# Altium project npm1300_qeaa_config3.PrjPCB
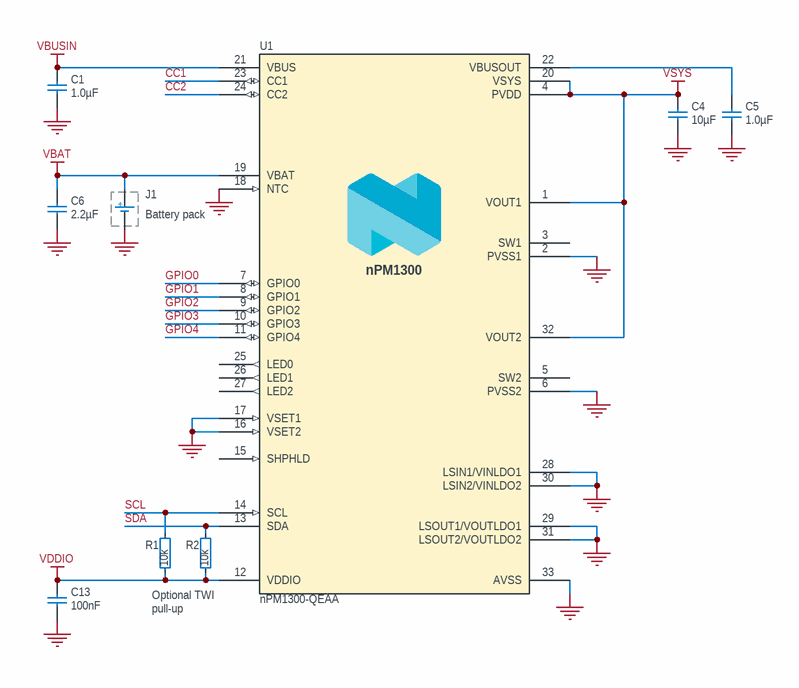
[diagram p0: npm1300_qeaa_config3.SchDoc]
1 sheet, 9 parts. Net scope: global (net labels, ports and power ports of the same name join across sheets).
Board file: npm1300_qeaa_config3.PcbDoc

## Sheet npm1300_qeaa_config3.SchDoc: nPM1300-QEAA Ref. Layout Config. 3
size A4; Revision: 1.2; SheetNumber: 1; SheetTotal: 1; DrawnBy: EISK; DocumentSize: A4; BoardTitle: nPM1300-QEAA Ref. Layout Config. 3; PCAName: nPM1300-QEAA; RefLayoutTitle: Minimal – only battery charging and VSYS output; Device: nPM1300-QEAA; Classification: PUBLIC; Config: 3

### Parts
C1  1.0µF  [CAPC1608X06L]
C4  10µF  [CAPC1608X06L]
C5  1.0µF  [CAPC1608X06L]
C6  2.2µF  [CAPC1608X06L]
C13  100nF  [CAPC0603X03L_C]
J1  Battery pack  [TP_2x1mm_TH]  (graphical)
R1  10k  [RESC0603X03L_C]
R2  10k  [RESC0603X03L_C]
U1  nPM1300-QEAA  [Nordic_QFN50P500X500X90-33N]

### Nets
GND: C1.1 C4.1 C5.1 C6.1 C13.2 J1.1(GND) U1.2(PVSS1) U1.6(PVSS2) U1.16(VSET2) U1.17(VSET1) U1.18(NTC) U1.28(LSIN1/VINLDO1) U1.29(LSOUT1/VOUTLDO1) U1.30(LSIN2/VINLDO2) U1.31(LSOUT2/VOUTLDO2) U1.33(AVSS)
VBAT: C6.2 J1.2(V+) U1.19(VBAT)
VBUSIN: C1.2 U1.21(VBUS)
VDDIO: C13.1 R1.2 R2.2 U1.12(VDDIO)
VSYS: C4.2 U1.1(VOUT1) U1.4(PVDD) U1.20(VSYS) U1.32(VOUT2)
CC1: U1.23(CC1)
CC2: U1.24(CC2)
GPIO0: U1.7(GPIO0)
GPIO1: U1.8(GPIO1)
GPIO2: U1.9(GPIO2)
GPIO3: U1.10(GPIO3)
GPIO4: U1.11(GPIO4)
SCL: R1.1 U1.14(SCL)
SDA: R2.1 U1.13(SDA)
NetC5_2: C5.2 U1.22(VBUSOUT)

Not connected (* = marked no-connect by the designer): U1 3(SW1) 5(SW2) 15(SHPHLD) 25(LED0) 26(LED1) 27(LED2)

### Notes on the sheet
- Optional TWI pull-up resistors
- Title
- Size
- Date:
- File:
- A4
- Config. No.
- Device
- Sheet
- Drawn By:
- Revision
- of
- Nordic Semiconductor does not warrant the accuracy or completeness of this documentation or any included information. Nordic Semiconductor makes no assurances that this design will meet specification, be appropriate for your application, or fit for any particular purpose, or that it will function in an implementation. Nordic Semiconductor also does not claim that the design is ready for production. It is your responsibility to thoroughly validate and test your design implementation to confirm the functionality of your application.
  © Nordic Semiconductor — All rights reserved.
- Classification:
- (in symbol Battery_TP) +
- (in symbol nPM1300-QEAA) nPM1300

### Library data of the parts
C1 C5 = C0603-1µ0-10V-X5R: Capacitor, Ceramic, 1.0µF 10V X5R 0603,±10%; Manufacturer: N.A.; Part number NEMS: 100200528; Pad Count: 2; Component Status: Active; Part Number: C0603-1µ0-10V-X5R; Manufacturer Part Number: N.A.; Footprint Doc: 0603; LatestRevisionDate: 2022-10-06; Published: 2022-10-06; Value: 1.0µF; Note: 10V; Artikkelnr Noca: N.A.; Part number IPS: N.A.; ComponentLink1URL: N.A.; ComponentLink1Description: Datasheet; ComponentLink2URL: N.A.; ComponentLink2Description: Supplier link; HelpURL: N.A.; Supplier 1: N.A.; Supplier Part Number 1: N.A.; Supplier 2: N.A.; Supplier Part Number 2: N.A.; Component Class: Capacitors; PartId: 100200528; Author: getr; Part number Norautron: N.A.
C4 = C0603-10µ: Capacitor, X5R, ±20%; Manufacturer: N.A.; Part number IPS: 00000007785; Part number NEMS: 100200275; Note: 6.3V; Artikkelnr Noca: 20039234; Pad Count: 2; Component Status: Active; Part Number: C0603-10µ; Manufacturer Part Number: N.A.; ComponentLink1URL: N.A.; ComponentLink1Description: Datasheet; ComponentLink2URL: N.A.; ComponentLink2Description: Supplier link; HelpURL: N.A.; Footprint Doc: 0603; LatestRevisionDate: 2011-01-17; Published: 2011-01-17; Value: 10µF; Supplier 1: N.A.; Supplier Part Number 1: N.A.; Supplier 2: N.A.; Supplier Part Number 2: N.A.; Component Class: Capacitors; PartId: 100200275; Author: rsk; Part number Norautron: N.A.
C6 = C0603-2.2µ-16V-X7R: Capacitor, Ceramic, X7R, ±10%, 16V; Manufacturer: Taiyo Yuden; Manufacturer Part Number: EMK107BB7225KA-T; Part number NEMS: 100200439; Component Status: Active; Pad Count: 2; Artikkelnr Noca: N.A.; Part Number: C0603-2.2µ-16V-X7R; PartId: 100200439; Component Class: Capacitors; Author: rsk; ComponentLink1URL: https://ds.yuden.co.jp/TYCOMPAS/ut/specSheet?pn=EMK107BB7225KA-T; ComponentLink1Description: Datasheet; ComponentLink2URL: https://ds.yuden.co.jp/TYCOMPAS/ut/detail?pn=EMK107BB7225KA-T&u=M; ComponentLink2Description: Supplier link; HelpURL: https://www.digikey.no/product-detail/en/taiyo-yuden/EMK107BB7225KA-T/587-5835-2-ND/4970646; LatestRevisionDate: 2020-10-13; Published: 2020-02-03; Footprint Doc: 0603; Value: 2.2µF; Note: 16V; Supplier 1: Digi-Key; Supplier Part Number 1: 587-5835-2-ND; Supplier 2: N.A.; Supplier Part Number 2: N.A.; Part number IPS: N.A.; Part number Norautron: N.A.
C13 = C0201-100n: Capacitor, X5R, ±10%, 100nF, 16V; Manufacturer: N.A.; Part number IPS: 00000001248, 00000002505; Part number Norautron: 262071862; Part number NEMS: 100200078; Pad Count: 2; Component Status: Active; Part Number: C0201-100n; PartId: 100200078; Component Class: Capacitors; Author: rsk; Manufacturer Part Number: N.A.; ComponentLink1URL: N.A.; ComponentLink1Description: Datasheet; ComponentLink2URL: N.A.; ComponentLink2Description: Supplier link; HelpURL: N.A.; Footprint Doc: 0201; LatestRevisionDate: 2024-06-27; Published: 2014-11-13; Value: 100nF; Note: 16V; Supplier 1: N.A.; Supplier Part Number 1: N.A.; Supplier 2: N.A.; Supplier Part Number 2: N.A.; Artikkelnr Noca: N.A.
J1 = Battery_TP: Manufacturer: N.A.; Part number NEMS: 101800006; Component Status: Active; Pad Count: 3; Part Number: Battery_TP; PartId: 101800006; Component Class: Batteries; Author: rsk; Manufacturer Part Number: N.A.; ComponentLink1URL: N.A.; ComponentLink1Description: Datasheet; ComponentLink2URL: N.A.; ComponentLink2Description: Supplier link; HelpURL: N.A.; LatestRevisionDate: 2020-09-22; Published: 2020-09-22; Footprint Doc: TP_2x1mm_TH; Value: Battery pack; Note: N.A.; Supplier 1: N.A.; Supplier Part Number 1: N.A.; Supplier 2: N.A.; Supplier Part Number 2: N.A.; Artikkelnr Noca: N.A.; Part number IPS: N.A.; Part number Norautron: N.A.
R1 R2 = R0201-10k: Resistor, ±1%, 0.05W; Manufacturer: N.A.; Part number IPS: 00000001255; Part number Norautron: 26107101; Part number NEMS: 100100065; Pad Count: 2; Note: Chip Res 1%; Component Status: Active; Part Number: R0201-10k; PartId: 100100065; Component Class: Resistors; Author: rsk; Manufacturer Part Number: N.A.; ComponentLink1URL: N.A.; ComponentLink1Description: Datasheet; ComponentLink2URL: N.A.; ComponentLink2Description: Supplier link; HelpURL: N.A.; Footprint Doc: 0201; LatestRevisionDate: 2014-11-13; Published: 2014-11-13; Value: 10k; Supplier 1: N.A.; Supplier Part Number 1: N.A.; Supplier 2: N.A.; Supplier Part Number 2: N.A.; Artikkelnr Noca: N.A.
U1 = nPM1300-QEAA: Li-Ion/Li-Polymer USB-C battery charger with high efficiency buck regulators, LDOs or load switches, LED drivers, TWI and VBUSOUT; Manufacturer: Nordic Semiconductor; Part number NEMS: 102000252; Component Status: Active; Pad Count: 33; Note: N.A.; Part Number: nPM1300-QEAA; PartId: 102000252; Component Class: nRF_Devices; Author: eisk; Manufacturer Part Number: nPM1300-QEAA; ComponentLink1URL: N.A.; ComponentLink1Description: Datasheet; ComponentLink2URL: N.A.; ComponentLink2Description: Supplier link; HelpURL: N.A.; LatestRevisionDate: 2022-11-14; Published: 2022-02-17; Footprint Doc: QFN-32; Value: nPM1300-QEAA; Supplier 1: Nordic Semiconductor; Supplier Part Number 1: nPM1300-QEAA; Supplier 2: N.A.; Supplier Part Number 2: N.A.; Artikkelnr Noca: N.A.; Part number IPS: N.A.; Part number Norautron: N.A.